# Altium schematic sheet HVP_PowerSupplyOpAmp_v1.0.SchDoc
size A3; Organization: SEW EURODRIVE; Address1: Jose Rubim Rd.; Address2: Santos Dumont Rd.; Address3: 205; Address4: Indaiatuba/SP; Address5: Brazil
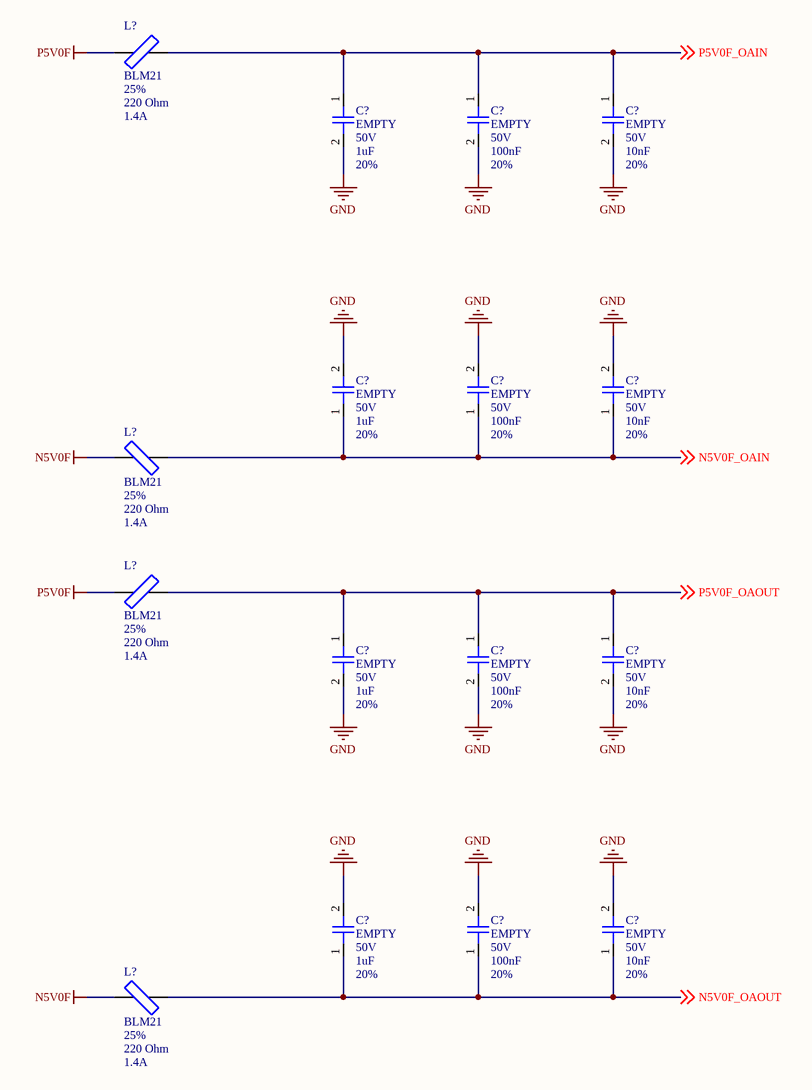
[diagram p0: HVP_PowerSupplyOpAmp_v1.0.SchDoc]

## Parts
(Parts that share a designator on the sheet are numbered #1, #2 ... from top to bottom, then left to right.)
C?#1  value 1uF  PartNumber1: EMPTY  Voltage: 50V  Tolerance: 20%  [CAP0603]  (hidden comment: CC0603)
C?#2  value 100nF  PartNumber1: EMPTY  Voltage: 50V  Tolerance: 20%  [CAP0603]  (hidden comment: CC0603)
C?#3  value 10nF  PartNumber1: EMPTY  Voltage: 50V  Tolerance: 20%  [CAP0603]  (hidden comment: CC0603)
C?#4  value 1uF  PartNumber1: EMPTY  Voltage: 50V  Tolerance: 20%  [CAP0603]  (hidden comment: CC0603)
C?#5  value 100nF  PartNumber1: EMPTY  Voltage: 50V  Tolerance: 20%  [CAP0603]  (hidden comment: CC0603)
C?#6  value 10nF  PartNumber1: EMPTY  Voltage: 50V  Tolerance: 20%  [CAP0603]  (hidden comment: CC0603)
C?#7  value 1uF  PartNumber1: EMPTY  Voltage: 50V  Tolerance: 20%  [CAP0603]  (hidden comment: CC0603)
C?#8  value 100nF  PartNumber1: EMPTY  Voltage: 50V  Tolerance: 20%  [CAP0603]  (hidden comment: CC0603)
C?#9  value 10nF  PartNumber1: EMPTY  Voltage: 50V  Tolerance: 20%  [CAP0603]  (hidden comment: CC0603)
C?#10  value 1uF  PartNumber1: EMPTY  Voltage: 50V  Tolerance: 20%  [CAP0603]  (hidden comment: CC0603)
C?#11  value 100nF  PartNumber1: EMPTY  Voltage: 50V  Tolerance: 20%  [CAP0603]  (hidden comment: CC0603)
C?#12  value 10nF  PartNumber1: EMPTY  Voltage: 50V  Tolerance: 20%  [CAP0603]  (hidden comment: CC0603)
L?#1  value 220 Ohm  Tolerance: 25%  Current: 1.4A  [IND0805]  (hidden comment: BLM21)
L?#2  value 220 Ohm  Tolerance: 25%  Current: 1.4A  [IND0805]  (hidden comment: BLM21)
L?#3  value 220 Ohm  Tolerance: 25%  Current: 1.4A  [IND0805]  (hidden comment: BLM21)
L?#4  value 220 Ohm  Tolerance: 25%  Current: 1.4A  [IND0805]  (hidden comment: BLM21)

## Nets
GND: C?#1.2 C?#2.2 C?#3.2 C?#4.2 C?#5.2 C?#6.2 C?#7.2 C?#8.2 C?#9.2 C?#10.2 C?#11.2 C?#12.2
N5V0F: L?#2.1 L?#4.1
P5V0F: L?#1.1 L?#3.1
N5V0F_OAIN: C?#4.1 C?#5.1 C?#6.1 L?#2.2 ; off-sheet N5V0F_OAIN
N5V0F_OAOUT: C?#10.1 C?#11.1 C?#12.1 L?#4.2 ; off-sheet N5V0F_OAOUT
P5V0F_OAIN: C?#1.1 C?#2.1 C?#3.1 L?#1.2 ; off-sheet P5V0F_OAIN
P5V0F_OAOUT: C?#7.1 C?#8.1 C?#9.1 L?#3.2 ; off-sheet P5V0F_OAOUT

## Notes on the sheet
- Title
- Author
- Checked By
- Size:
- Revision:
- A3
- Date:
- Project
- Time:
- Sheet
- of
- File:

## Library data of the parts
C?#1-C?#12 = CC0603: Surface Mount Multilayer Ceramic Chip Capacitors  for Commercial Applications; Manufacter1: Yageo; Published: 19-Jun-2016; LatestRevisionDate: 19-Jun-2016; Publisher: Lucas Moraes; PackageReference: CAP0603; PackageDescription: CAP0603;2 Leads
L?#1-L?#4 = BLM21: Ferrite Beads 0805; Manufacter1: Murata Electronics; LatestRevisionDate: 05-Apr-2023; PackageReference: IND0805; Publisher: Lucas Moraes; PackageDescription: IND0805; 2 Leads; Published: 05-Apr-2023; Datasheet: https://br.mouser.com/datasheet/2/281/ENFA0005-1915781.pdf; Code: *; PartNumber1: BLM21